# EAGLE schematic Rain-CPU-025 (EAGLE 7.3.0)
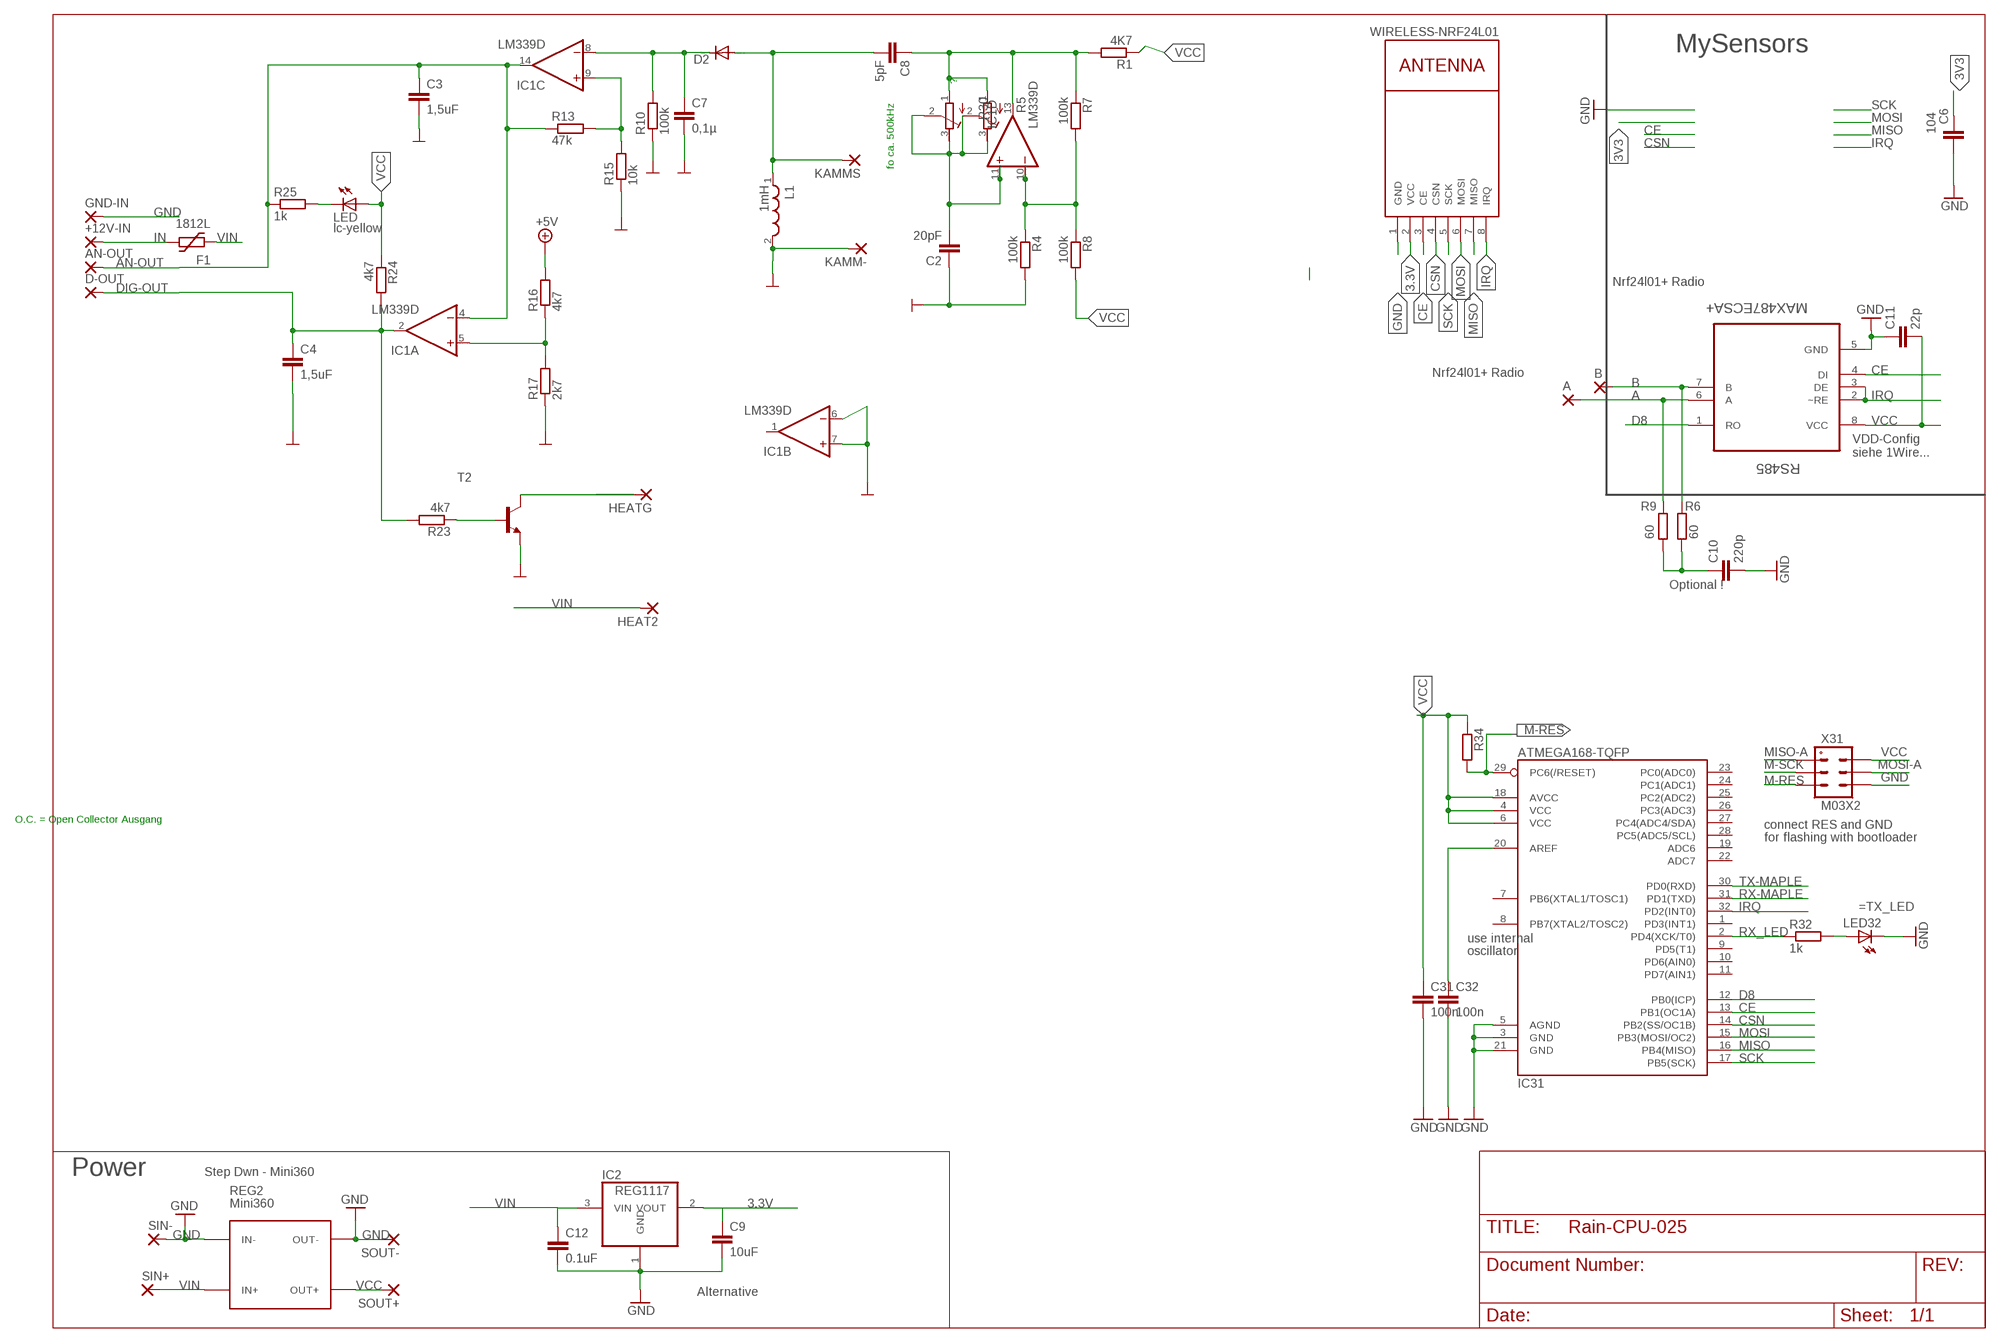
[diagram p0: schematic, sheet 1]

## Parts
+12V-IN  WIREPADSMD5-1,8  [5-1,8]
A  WIREPADSMD5-1,8  [5-1,8]
AN-OUT  WIREPADSMD5-1,8  [5-1,8]
B  WIREPADSMD5-1,8  [5-1,8]
C2  20pF  C-EUC1206  [C1206]
C3  1,5uF  10UF-1210-50V-20%  [1210]
C4  1,5uF  10UF-1210-50V-20%  [1210]
C6  104  C-EUC0805  [C0805]
C7  0,1µ  C-EUC1206  [C1206]
C8  5pF  C-EUC1206  [C1206]
C9  10uF  C-EUC1210  [C1210]
C10  220p  C-EUC0805  [C0805]
C11  22p  C-EUC0805  [C0805]
C12  0.1uF  C-EUC1206  [C1206]
C31  100n  C-EUC0805  [C0805]
C32  100n  C-EUC0805  [C0805]
D2  DIODE-MELF-MLL41  [MELF-MLL41]
D-OUT  WIREPADSMD5-1,8  [5-1,8]
F1  1812L  [1812L]
GND-IN  WIREPADSMD5-1,8  [5-1,8]
HEAT2  WIREPADSMD5-1,8  [5-1,8]
HEATG  WIREPADSMD5-1,8  [5-1,8]
IC1  LM339D  [SO14]
IC2  REG1117  [SOT223]
IC31  ATMEGA168-TQFP  [TQFP32-08]
KAMM-  WIREPADSMD5-1,8  [5-1,8]
KAMMS  WIREPADSMD5-1,8  [5-1,8]
L1  1mH  WE-LQ_1210  [WE-LQ_M]
LED  lc-yellow  LEDCHIPLED_0805  [CHIPLED_0805]
LED32  LEDCHIPLED_0805  [CHIPLED_0805]
NRF24L01+  WIRELESS-NRF24L01  [WIRELESS-NRF24L01]
R1  4K7  R-EU_M0805  [M0805]
R4  100k  R-EU_M0805  [M0805]
R5  R-TRIMM5X  [RTRIM5X]
R6  60  R-EU_R0805  [R0805]
R7  100k  R-EU_M0805  [M0805]
R8  100k  R-EU_M0805  [M0805]
R9  60  R-EU_R0805  [R0805]
R10  100k  R-EU_M0805  [M0805]
R13  47k  R-EU_M0805  [M0805]
R15  10k  R-EU_M0805  [M0805]
R16  4k7  R-EU_M0805  [M0805]
R17  2k7  R-EU_M0805  [M0805]
R23  4k7  R-EU_M0805  [M0805]
R24  4k7  R-EU_M0805  [M0805]
R25  1k  R-EU_M0805  [M0805]
R30  R-TRIMMTS63Z  [RTRIMTS63Z]
R32  1k  R-EU_R0805  [R0805]
R34  R-EU_R0805  [R0805]
REG2  Mini360  DC-DC-STEP-DOWN-MP2307  [DC-DC-STEP-DOWN-MP2307]
RS485  MAX487ECSA+  [SOIC127P600X175-8N]
SIN+  WIREPADSMD1,27-254  [SMD1,27-2,54]
SIN-  WIREPADSMD1,27-254  [SMD1,27-2,54]
SOUT+  WIREPADSMD1,27-254  [SMD1,27-2,54]
SOUT-  WIREPADSMD1,27-254  [SMD1,27-2,54]
T2  BC868-NPN-SOT89-BCE  [SOT89-BCE]
X31  M03X2  [2X03-1.27MM_SMD]

## Nets
3.3V [PWR]: C9.1 IC2.2(VOUT) NRF24L01+.2(VCC)
3V3 [PWR]: C6.1
-HEIZUNG_O.C. [PWR]: HEATG.1(P) T2.C
A: A.1(P) R9.2 RS485.6(A)
AN-OUT: AN-OUT.1(P) C3.1 IC1.4(A:-IN) IC1.14(C:OUT) R13.1 R25.1
B: B.1(P) R6.2 RS485.7(B)
CE: IC31.13(PB1(OC1A)) NRF24L01+.3(CE) RS485.4(DI)
CSN: IC31.14(PB2(SS/OC1B)) NRF24L01+.4(CSN)
D8: IC31.12(PB0(ICP)) RS485.1(RO)
DIG-OUT: C4.1 D-OUT.1(P) IC1.2(A:OUT) R23.2 R24.2
GND [PWR]: C2.1 C3.2 C4.2 C6.2 C7.2 C9.2 C10.2 C11.1 C12.2 C31.2 C32.2 GND-IN.1(P) IC1.6(B:-IN) IC1.7(B:+IN) IC2.1(GND) IC31.3(GND) IC31.5(AGND) IC31.21(GND) KAMM-.1(P) L1.2 LED32.C NRF24L01+.1(GND) R4.2 R10.1 R15.1 R17.1 REG2.IN- REG2.OUT- RS485.5(GND) SIN-.1(P) SOUT-.1(P) T2.E X31.P$6
IN [PWR]: +12V-IN.1(P) F1.P$2
IRQ: IC31.32(PD2(INT0)) NRF24L01+.8(IRQ) RS485.2(~RE) RS485.3(DE)
KAMMSENSOR: C8.2 D2.A KAMMS.1(P) L1.1
M-RES: IC31.29(PC6(/RESET)) R34.2 X31.P$5
M-SCK: X31.P$3
MISO: IC31.16(PB4(MISO)) NRF24L01+.7(MISO)
MISO-A: X31.P$1
MOSI: IC31.15(PB3(MOSI/OC2)) NRF24L01+.6(MOSI)
MOSI-A: X31.P$4
N$1: C10.1 R6.1 R9.1
N$5: LED32.A R32.2
N$14: C8.1 IC1.13(D:OUT) R1.2 R5.1(A) R7.1 R30.1(A)
N$15: C32.1 IC31.20(AREF)
N$16: IC1.10(D:-IN) R4.1 R7.2 R8.1
N$17: C2.2 IC1.11(D:+IN) R5.2(S) R5.3(E) R30.2(S) R30.3(E)
N$18: C7.1 D2.C IC1.8(C:-IN) R10.2
N$19: IC1.5(A:+IN) R16.1 R17.2
N$20: R23.1 T2.B
N$21: LED.C R25.2
N$1000: IC1.9(C:+IN) R13.2 R15.2
RX-MAPLE: IC31.31(PD1(TXD))
RX_LED: IC31.2(PD4(XCK/T0)) R32.1
SCK: IC31.17(PB5(SCK)) NRF24L01+.5(SCK)
TX-MAPLE: IC31.30(PD0(RXD))
VCC [PWR]: C11.2 C31.1 IC31.4(VCC) IC31.6(VCC) IC31.18(AVCC) LED.A R1.1 R8.2 R16.2 R24.1 R34.1 REG2.OUT+ RS485.8(VCC) SOUT+.1(P) X31.P$2 ; supply symbol labelled +5V
VIN [PWR]: C12.1 F1.P$1 HEAT2.1(P) IC2.3(VIN) REG2.IN+ SIN+.1(P)
Unconnected: IC1.1(B:OUT) IC31.1(PD3(INT1)) IC31.7(PB6(XTAL1/TOSC1)) IC31.8(PB7(XTAL2/TOSC2)) IC31.9(PD5(T1)) IC31.10(PD6(AIN0)) IC31.11(PD7(AIN1)) IC31.19(ADC6) IC31.22(ADC7) IC31.23(PC0(ADC0)) IC31.24(PC1(ADC1)) IC31.25(PC2(ADC2)) IC31.26(PC3(ADC3)) IC31.27(PC4(ADC4/SDA)) IC31.28(PC5(ADC5/SCL))

## Notes on the sheet
- MySensors
- ?
- fo ca. 500kHz
- Nrf24l01+ Radio
- Nrf24l01+ Radio
- VDD-Config
  siehe 1Wire...
- Optional !
- O.C. = Open Collector Ausgang
- connect RES and GND
- for flashing with bootloader
- =TX_LED
- use internal
- oscillator
- Power | Step Dwn - Mini360
- Alternative

## Power pins joined to a net without a drawn wire
GND: IC1.12(P:GND)
V+: IC1.3(P:V+)

## Library data of the parts
+12V-IN A AN-OUT B D-OUT GND-IN HEAT2 HEATG KAMM- KAMMS SIN+ SIN- SOUT+ SOUT- = wirepad:WIREPAD: Wire PAD connect wire on PCB
C2 C7-C12 C31 C32 = rcl:C-EU: CAPACITOR, European symbol
C3 C4 = SparkFun-Capacitors:10UF: 10.0µF ceramic capacitors A capacitor is a passive two-terminal electrical component used to store electrical energy temporarily in an electric field.; PROD_ID: CAP-09824; VALUE: 10uF
C6 = resistor:C-EU: CAPACITOR, European symbol
D2 = diode:DIODE-: DIODE
F1 = ptc-littlefuse:1812L
IC1 = linear:LM339: Low Power Low Offset Voltage Quad Comparators with open collector; LM139/LM239/LM339/LM2901/LM3302
IC2 = burr-brown:REG1117: 800mA and 1A Low Dropout (LDO) Positive Regulator 1.8V, 2.5V, 2.85V, 3.3V, 5V, and Adj; MPN: REG1117; OC_FARNELL: 1097566; OC_NEWARK: 14P6981
IC31 = atmel:ATMEGA168: Atmel Atmega 168/328/328P
L1 = EAGLE-EMC_COMPONENTS-rev17a:WE-LQ: SMD Inductor Characteristics Miniature chip inductor wound on a special ferrite core Small inductances for compact circuits High Q at high frequencies Low DC-resistance Operating temperature: –40 ºC to +125 ºC Applications Low power DC/DC-converters from Linear Technology, National Semiconductor, Texas Instruments, Fairchild Semiconductor, ON Semiconductor, STMicroelectronics, Maxim, MPS, Semtech, Exar, Analogic Tech, Diodes and Cologne Chip EMI-Filtering RF-circuits <http://katalog.we-online.de/media/images/eisos/IndLQ_pf2.jpg> Details see: http://katalog.we-online.de/en/pbs/WE-LQ? Updated by Dan Xu 2014-07-08 2014 (C) Wurth Elektronik
LED LED32 = led:LED: LED OSRAM: - CHIPLED LG R971, LG N971, LY N971, LG Q971, LY Q971, LO R971, LY R971 LH N974, LH R974 LS Q976, LO Q976, LY Q976 LO Q996 - Hyper CHIPLED LW Q18S LB Q993, LB Q99A, LB R99A - SideLED LS A670, LO A670, LY A670, LG A670, LP A670 LB A673, LV A673, LT A673, LW A673 LH A674 LY A675 LS A676, LA A676, LO A676, LY A676, LW A676 LS A679, LY A679, LG A679 - Hyper Micro SIDELED® LS Y876, LA Y876, LO Y876, LY Y876 LT Y87S - SmartLED LW L88C, LW L88S LB L89C, LB L89S, LG L890 LS L89K, LO L89K, LY L89K LS L896, LA L896, LO L896, LY L896 - TOPLED LS T670, LO T670, LY T670, LG T670, LP T670 LSG T670, LSP T670, LSY T670, LOP T670, LYG T670 LG T671, LOG T671, LSG T671 LB T673, LV T673, LT T673, LW T673 LH T674 LS T676, LA T676, LO T676, LY T676, LB T676, LH T676, LSB T676, LW T676 LB T67C, LV T67C, LT T67C, LS T67K, LO T67K, LY T67K, LW E67C LS E67B, LA E67B, LO E67B, LY E67B, LB E67C, LV E67C, LT E67C LW T67C LS T679, LY T679, LG T679 LS T770, LO T770, LY T770, LG T770, LP T770 LB T773, LV T773, LT T773, LW T773 LH T774 LS E675, LA E675, LY E675, LS T675 LS T776, LA T776, LO T776, LY T776, LB T776 LHGB T686 LT T68C, LB T68C - Hyper Mini TOPLED® LB M676 - Mini TOPLED Santana® LG M470 LS M47K, LO M47K, LY M47K Source: http://www.osram.convergy.de LUXEON: - LUMILED® LXK2-PW12-R00, LXK2-PW12-S00, LXK2-PW14-U00, LXK2-PW14-V00 LXK2-PM12-R00, LXK2-PM12-S00, LXK2-PM14-U00 LXK2-PE12-Q00, LXK2-PE12-R00, LXK2-PE12-S00, LXK2-PE14-T00, LXK2-PE14-U00 LXK2-PB12-K00, LXK2-PB12-L00, LXK2-PB12-M00, LXK2-PB14-N00, LXK2-PB14-P00, LXK2-PB14-Q00 LXK2-PR12-L00, LXK2-PR12-M00, LXK2-PR14-Q00, LXK2-PR14-R00 LXK2-PD12-Q00, LXK2-PD12-R00, LXK2-PD12-S00 LXK2-PH12-R00, LXK2-PH12-S00 LXK2-PL12-P00, LXK2-PL12-Q00, LXK2-PL12-R00 Source: www.luxeon.com KINGBRIGHT: KA-3528ASYC Source: www.kingbright.com
NRF24L01+ = diy-modules:WIRELESS-NRF24L01: 2.4 GHz Wireless Module based on NRF24L01 chip
R1 R4 R6-R10 R13 R15-R17 R23-R25 R32 R34 = rcl:R-EU_: RESISTOR, European symbol
R5 R30 = rcl:R-TRIMM: Trimm resistor
REG2 = diy-modules:DC-DC-STEP-DOWN-MP2307: DC/DC Step-Down Regulator based on MP2307DN chip MP2307 datasheet available here: https://cdn-shop.adafruit.com/datasheets/MP2307_r1.9.pdf Click here to find device on ebay.com <http://www.ebay.com/sch/dc+dc+3a+mini+converter>
RS485 = Maxim_By_element14_Batch_1:MAX487ECSA+: Low-Power, Slew-Rate-Limited RS-485/RS-422 Transceivers; MPN: MAX487ECSA+; OC_FARNELL: 9724532; OC_NEWARK: 68K4803; PACKAGE: SOIC-8; SUPPLIER: Maxim
T2 = transistor:*-NPN-: NPN Transistror BF959 corrected 2008.03.06
X31 = mechanics:M03X2

## Net classes
0 default: width 0.305 mm
1 PWR: width 0.457 mm